# EAGLE schematic Project 3 (EAGLE 6.5.1)
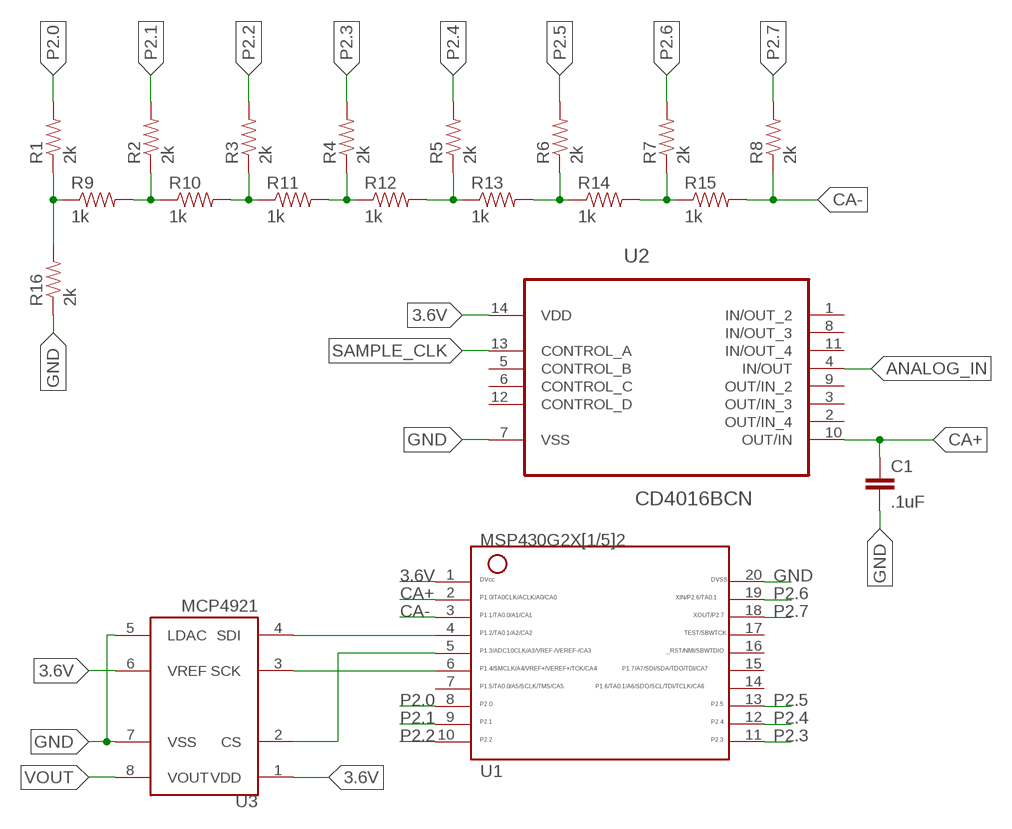
[diagram p0: schematic, sheet 1]

## Parts
C1  .1uF  CAP0603-CAP  [0603-CAP]
R1  2k  RESISTOR0603  [0603-RES]
R2  2k  RESISTOR0603  [0603-RES]
R3  2k  RESISTOR0603  [0603-RES]
R4  2k  RESISTOR0603  [0603-RES]
R5  2k  RESISTOR0603  [0603-RES]
R6  2k  RESISTOR0603  [0603-RES]
R7  2k  RESISTOR0603  [0603-RES]
R8  2k  RESISTOR0603  [0603-RES]
R9  1k  RESISTOR0603  [0603-RES]
R10  1k  RESISTOR0603  [0603-RES]
R11  1k  RESISTOR0603  [0603-RES]
R12  1k  RESISTOR0603  [0603-RES]
R13  1k  RESISTOR0603  [0603-RES]
R14  1k  RESISTOR0603  [0603-RES]
R15  1k  RESISTOR0603  [0603-RES]
R16  2k  RESISTOR0603  [0603-RES]
U1  G2X[1/5]2---N20  [N20]
U2  CD4016BCN  [DIP254P762X508-14]
U3  MCP4921  [DIL8]

## Nets
3.6V: U1.1 U2.14(VDD) U3.1(VDD) U3.6(VREF)
ANALOG_IN: U2.4(IN/OUT)
CA+: C1.1 U1.2 U2.10(OUT/IN)
CA-: R8.1 R15.2 U1.3
GND: C1.2 R16.1 U1.20 U2.7(VSS) U3.5(LDAC) U3.7(VSS)
N$1: R1.1 R9.1 R16.2
N$2: R2.1 R9.2 R10.1
N$3: R3.1 R10.2 R11.1
N$4: R4.1 R11.2 R12.1
N$5: R5.1 R12.2 R13.1
N$6: R6.1 R13.2 R14.1
N$7: R7.1 R14.2 R15.1
N$8: U1.4 U3.4(SDI)
N$9: U1.6 U3.3(SCK)
N$10: U1.5 U3.2(CS)
P2.0: R1.2 U1.8
P2.1: R2.2 U1.9
P2.2: R3.2 U1.10
P2.3: R4.2 U1.11
P2.4: R5.2 U1.12
P2.5: R6.2 U1.13
P2.6: R7.2 U1.19
P2.7: R8.2 U1.18
SAMPLE_CLK: U2.13(CONTROL_A)
VOUT: U3.8(VOUT)
Unconnected: U1.7 U1.14 U1.15 U1.16 U1.17 U2.1(IN/OUT_2) U2.2(OUT/IN_4) U2.3(OUT/IN_3) U2.5(CONTROL_B) U2.6(CONTROL_C) U2.8(IN/OUT_3) U2.9(OUT/IN_2) U2.11(IN/OUT_4) U2.12(CONTROL_D)

## Library data of the parts
C1 = SparkFun-Capacitors:CAP: Capacitor Standard 0603 ceramic capacitor, and 0.1" leaded capacitor.
R1-R16 = SparkFun-Resistors:RESISTOR: Resistor Basic schematic elements and footprints for 0603, 1206, and PTH resistors.
U1 = TI_MSP430_v16:G2X[1/5]2---N20: MSP430G2X[1/5]2 MSP430G2x52, MSP430G2x12 PDIP (N) 20 Pin Package http://focus.ti.com/docs/prod/folders/print/msp430g2452.html
U2 = Fairchild_By_element14_Batch_1:CD4016BCN: Quad Bilateral Switch; MPN: CD4016BCN; OC_FARNELL: 1014070; OC_NEWARK: 58K8789; PACKAGE: PDIP-14; SUPPLIER: FAIRCHILD SEMICONDUCTOR
U3 = microchip:MCP4921